# EAGLE schematic MainBoard (EAGLE 9.3.2)
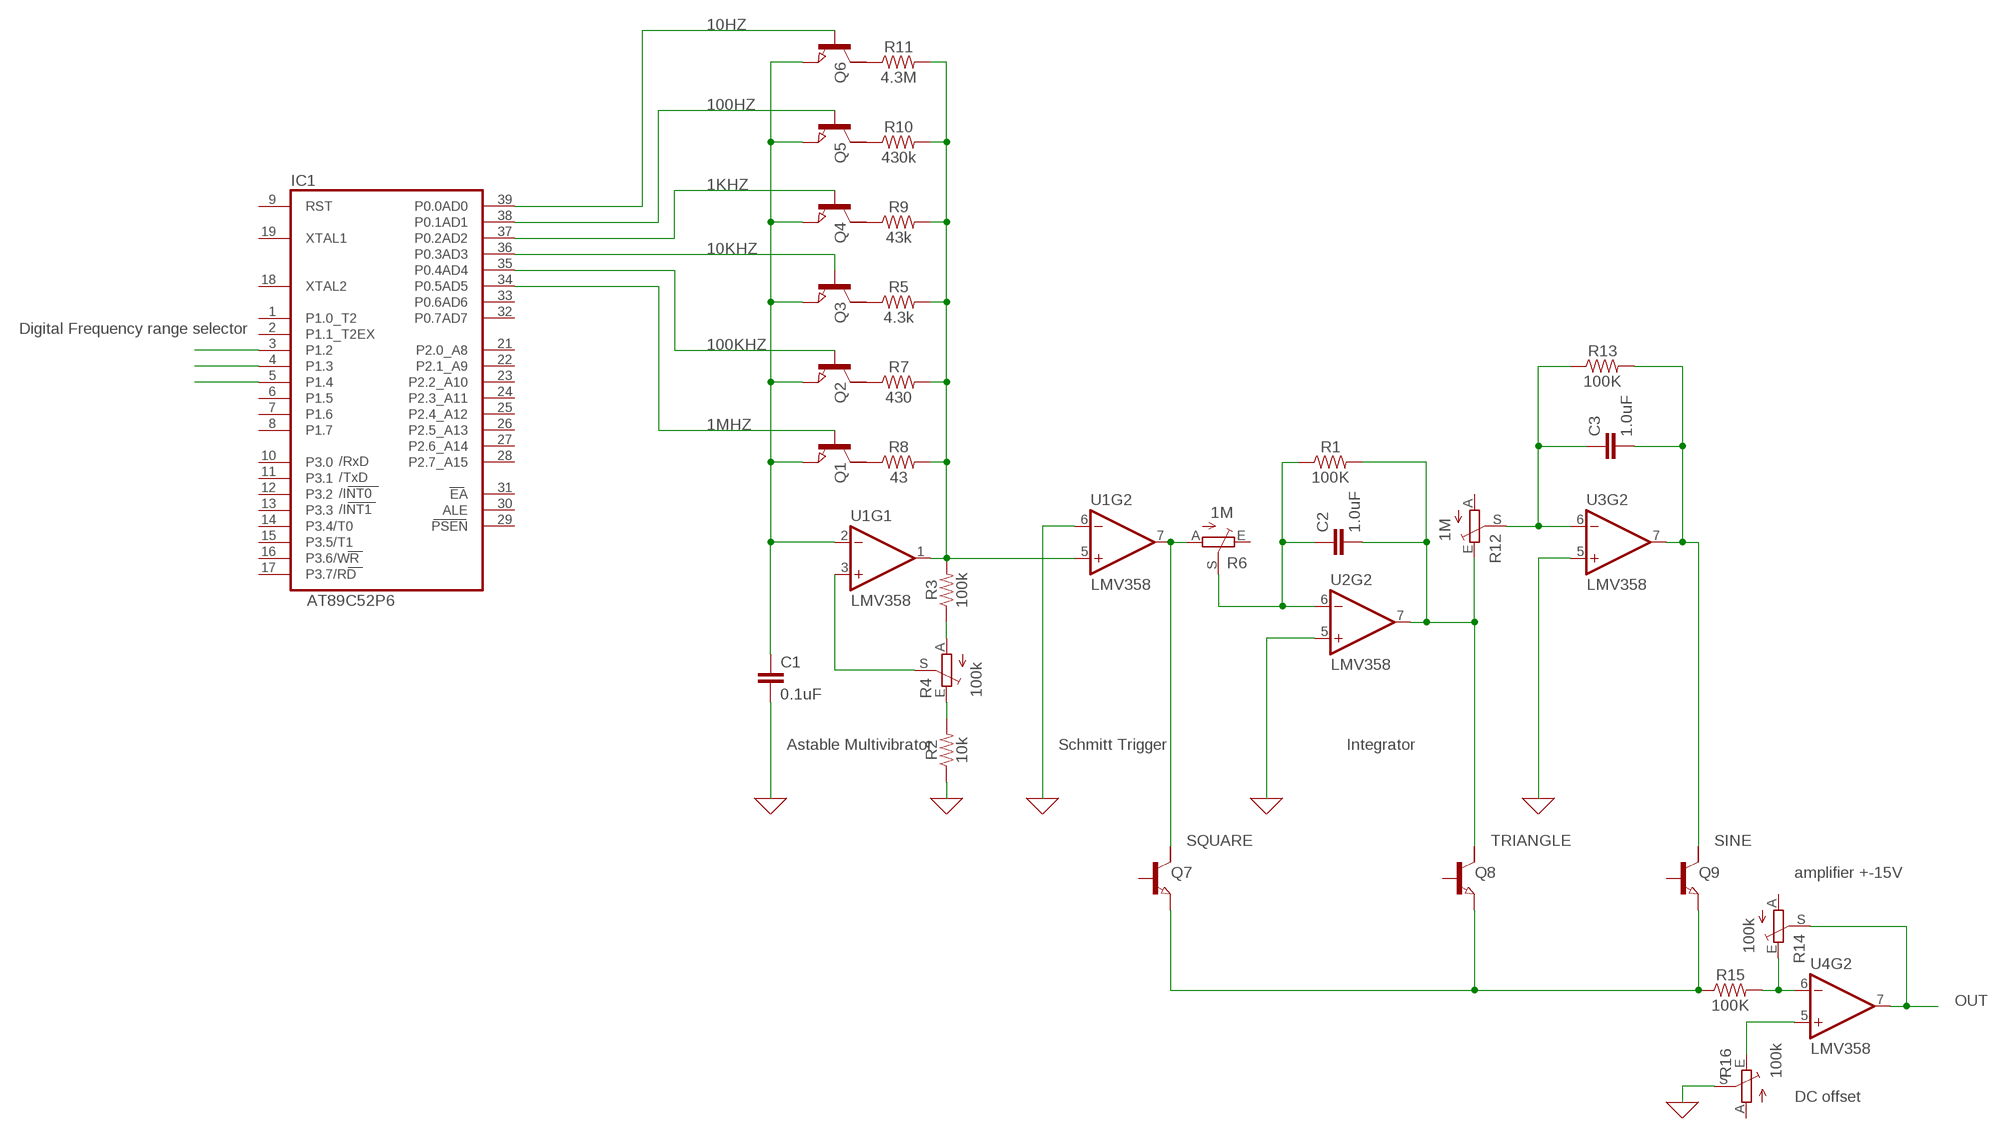
[diagram p0: schematic, sheet 1]

## Parts
C1  0.1uF  0.1UF-0402-16V-10%  [0402]
C2  1.0uF  1.0UF-0402-16V-10%  [0402]
C3  1.0uF  1.0UF-0402-16V-10%  [0402]
IC1  AT89C52P6  [DIL40]
Q1  NPN-TRANSISTIOR-2COLSOT89  [SOT89]
Q2  NPN-TRANSISTIOR-2COLSOT89  [SOT89]
Q3  NPN-TRANSISTIOR-2COLSOT89  [SOT89]
Q4  NPN-TRANSISTIOR-2COLSOT89  [SOT89]
Q5  NPN-TRANSISTIOR-2COLSOT89  [SOT89]
Q6  NPN-TRANSISTIOR-2COLSOT89  [SOT89]
Q7  NPN-TRANSISTIOR-2COLSOT89  [SOT89]
Q8  NPN-TRANSISTIOR-2COLSOT89  [SOT89]
Q9  NPN-TRANSISTIOR-2COLSOT89  [SOT89]
R1  100K  100KOHM-0402-1/16W-1%  [0402]
R2  10k  715OHM-0603-1/10W-1%  [0603]
R3  100k  220KOHM-0603-1/10W-1%  [0603]
R4  100k  TRIM_1234-S64YW  [S64YW]
R5  4.3k  43KOHM-0603-1/10W-1%  [0603]
R6  1M  TRIM_1234-S64YW  [S64YW]
R7  430  43KOHM-0603-1/10W-1%  [0603]
R8  43  43KOHM-0603-1/10W-1%  [0603]
R9  43k  43KOHM-0603-1/10W-1%  [0603]
R10  430k  43KOHM-0603-1/10W-1%  [0603]
R11  4.3M  43KOHM-0603-1/10W-1%  [0603]
R12  1M  TRIM_1234-S64YW  [S64YW]
R13  100K  100KOHM-0402-1/16W-1%  [0402]
R14  100k  TRIM_1234-S64YW  [S64YW]
R15  100K  100KOHM-0402-1/16W-1%  [0402]
R16  100k  TRIM_1234-S64YW  [S64YW]
U1  LMV358  LMV358SOIC  [SO08]
U2  LMV358  LMV358SOIC  [SO08]
U3  LMV358  LMV358SOIC  [SO08]
U4  LMV358  LMV358SOIC  [SO08]

## Nets
0: C1.2 R2.1 R16.S U1.6(-IN) U2.5(+IN) U3.5(+IN) ; supply symbol labelled GND
1KHZ: IC1.37(P0.2AD2) Q4.1(B)
1MHZ: IC1.34(P0.5AD5) Q1.1(B)
10HZ: IC1.39(P0.0AD0) Q6.1(B)
10KHZ: IC1.36(P0.3AD3) Q3.1(B)
100HZ: IC1.38(P0.1AD1) Q5.1(B)
100KHZ: IC1.35(P0.4AD4) Q2.1(B)
N$1: R3.1 R4.A
N$2: C1.1 Q1.3(E) Q2.3(E) Q3.3(E) Q4.3(E) Q5.3(E) Q6.3(E) U1.2(-IN)
N$3: R3.2 R5.2 R7.2 R8.2 R9.2 R10.2 R11.2 U1.1(OUT) U1.5(+IN)
N$4: R2.2 R4.E
N$5: R4.S U1.3(+IN)
N$6: C3.1 R12.S R13.1 U3.6(-IN)
N$7: C2.1 R1.1 R6.S U2.6(-IN)
N$8: Q7.3(E) Q8.3(E) Q9.3(E) R15.1
N$9: Q1.2(C) R8.1
N$10: Q2.2(C) R7.1
N$11: Q3.2(C) R5.1
N$12: Q4.2(C) R9.1
N$13: Q5.2(C) R10.1
N$14: Q6.2(C) R11.1
N$15: R14.E R15.2 U4.6(-IN)
N$16: R16.E U4.5(+IN)
N$21: IC1.3(P1.2)
N$22: IC1.4(P1.3)
N$23: IC1.5(P1.4)
OUT: R14.S U4.7(OUT)
SINE: C3.2 Q9.2(C) R13.2 U3.7(OUT)
SQUARE: Q7.2(C) R6.A U1.7(OUT)
TRIANGLE: C2.2 Q8.2(C) R1.2 R12.E U2.7(OUT)
Unconnected: IC1.1(P1.0_T2) IC1.2(P1.1_T2EX) IC1.6(P1.5) IC1.7(P1.6) IC1.8(P1.7) IC1.9(RST) IC1.10(P3.0) IC1.11(P3.1) IC1.12(P3.2) IC1.13(P3.3) IC1.14(P3.4/T0) IC1.15(P3.5/T1) IC1.16(P3.6/WR) IC1.17(P3.7/RD) IC1.18(XTAL2) IC1.19(XTAL1) IC1.21(P2.0_A8) IC1.22(P2.1_A9) IC1.23(P2.2_A10) IC1.24(P2.3_A11) IC1.25(P2.4_A12) IC1.26(P2.5_A13) IC1.27(P2.6_A14) IC1.28(P2.7_A15) IC1.29(PSEN) IC1.30(ALE) IC1.31(EA) IC1.32(P0.7AD7) IC1.33(P0.6AD6) Q1.2@1(C/) Q2.2@1(C/) Q3.2@1(C/) Q4.2@1(C/) Q5.2@1(C/) Q6.2@1(C/) Q7.1(B) Q7.2@1(C/) Q8.1(B) Q8.2@1(C/) Q9.1(B) Q9.2@1(C/) R4.S@1(S) R6.E R6.S@1(S) R12.A R12.S@1(S) R14.A R14.S@1(S) R16.A R16.S@1(S) U1.4(P$V-) U1.8(P$V+) U2.1(OUT) U2.2(-IN) U2.3(+IN) U2.4(P$V-) U2.8(P$V+) U3.1(OUT) U3.2(-IN) U3.3(+IN) U3.4(P$V-) U3.8(P$V+) U4.1(OUT) U4.2(-IN) U4.3(+IN) U4.4(P$V-) U4.8(P$V+)

## Notes on the sheet
- Digital Frequency range selector
- Astable Multivibrator | Schmitt Trigger | Integrator
- amplifier +-15V
- DC offset

## Power pins joined to a net without a drawn wire
GND: IC1.20(GND)
VCC: IC1.40(VCC)

## Library data of the parts
C1 = SparkFun-Capacitors:0.1UF: 0.1µF ceramic capacitors A capacitor is a passive two-terminal electrical component used to store electrical energy temporarily in an electric field.; PROD_ID: CAP-12416
C2 C3 = SparkFun-Capacitors:1.0UF: 1µF ceramic capacitors A capacitor is a passive two-terminal electrical component used to store electrical energy temporarily in an electric field.; PROD_ID: CAP-12417
IC1 = atmel:AT89C*52: MICROCONTROLLER 8 Kbytes FLASH; 2K Bytes EEPROM Compatible with MCS-51 Products at89s8252.pdf; OC_FARNELL: unknown; OC_NEWARK: unknown
Q1-Q9 = semicon-smd-ipc:NPN-TRANSISTIOR-2COL: NPN TRANSISTOR 2 colletor pins
R1 R13 R15 = SparkFun-Resistors:100KOHM: 100kΩ resistor A resistor is a passive two-terminal electrical component that implements electrical resistance as a circuit element. Resistors act to reduce current flow, and, at the same time, act to lower voltage levels within circuits. - Wikipedia; PROD_ID: RES-13495
R2 = SparkFun-Resistors:715OHM: 715Ω resistor A resistor is a passive two-terminal electrical component that implements electrical resistance as a circuit element. Resistors act to reduce current flow, and, at the same time, act to lower voltage levels within circuits. - Wikipedia; PROD_ID: RES-07850; VALUE: 715
R3 = SparkFun-Resistors:220KOHM: 220kΩ resistor A resistor is a passive two-terminal electrical component that implements electrical resistance as a circuit element. Resistors act to reduce current flow, and, at the same time, act to lower voltage levels within circuits. - Wikipedia; PROD_ID: RES-08969; VALUE: 220k
R4 R6 R12 R14 R16 = pot:TRIM_1234-: POTENTIOMETER
R5 R7 R8 R10 R11 = SparkFun-Resistors:43KOHM: 43kΩ resistor A resistor is a passive two-terminal electrical component that implements electrical resistance as a circuit element. Resistors act to reduce current flow, and, at the same time, act to lower voltage levels within circuits. - Wikipedia; PROD_ID: RES-07858; VALUE: 43k
R9 = SparkFun-Resistors:43KOHM: 43kΩ resistor A resistor is a passive two-terminal electrical component that implements electrical resistance as a circuit element. Resistors act to reduce current flow, and, at the same time, act to lower voltage levels within circuits. - Wikipedia; PROD_ID: RES-07858
U1-U4 = SparkFun-IC-Amplifiers:LMV358: IC LMV358 DUAL OP AMP Jellybean rail-to-rail output op-amp SparkFun Products SparkFun PicoBoard <https://www.sparkfun.com/products/11888> (WIG-11888) SparkFun Vernier Interface Shield <https://www.sparkfun.com/products/12858> (DEV-12858) SparkFun Blynk Board - ESP8266 <https://www.sparkfun.com/products/13794> (WRL-13794) SparkFun Digital Sandbox <https://www.sparkfun.com/products/12651> (DEV-12651 RoHS); PROD_ID: IC-09657